# EAGLE design bms_board (EAGLE 6.5.0)
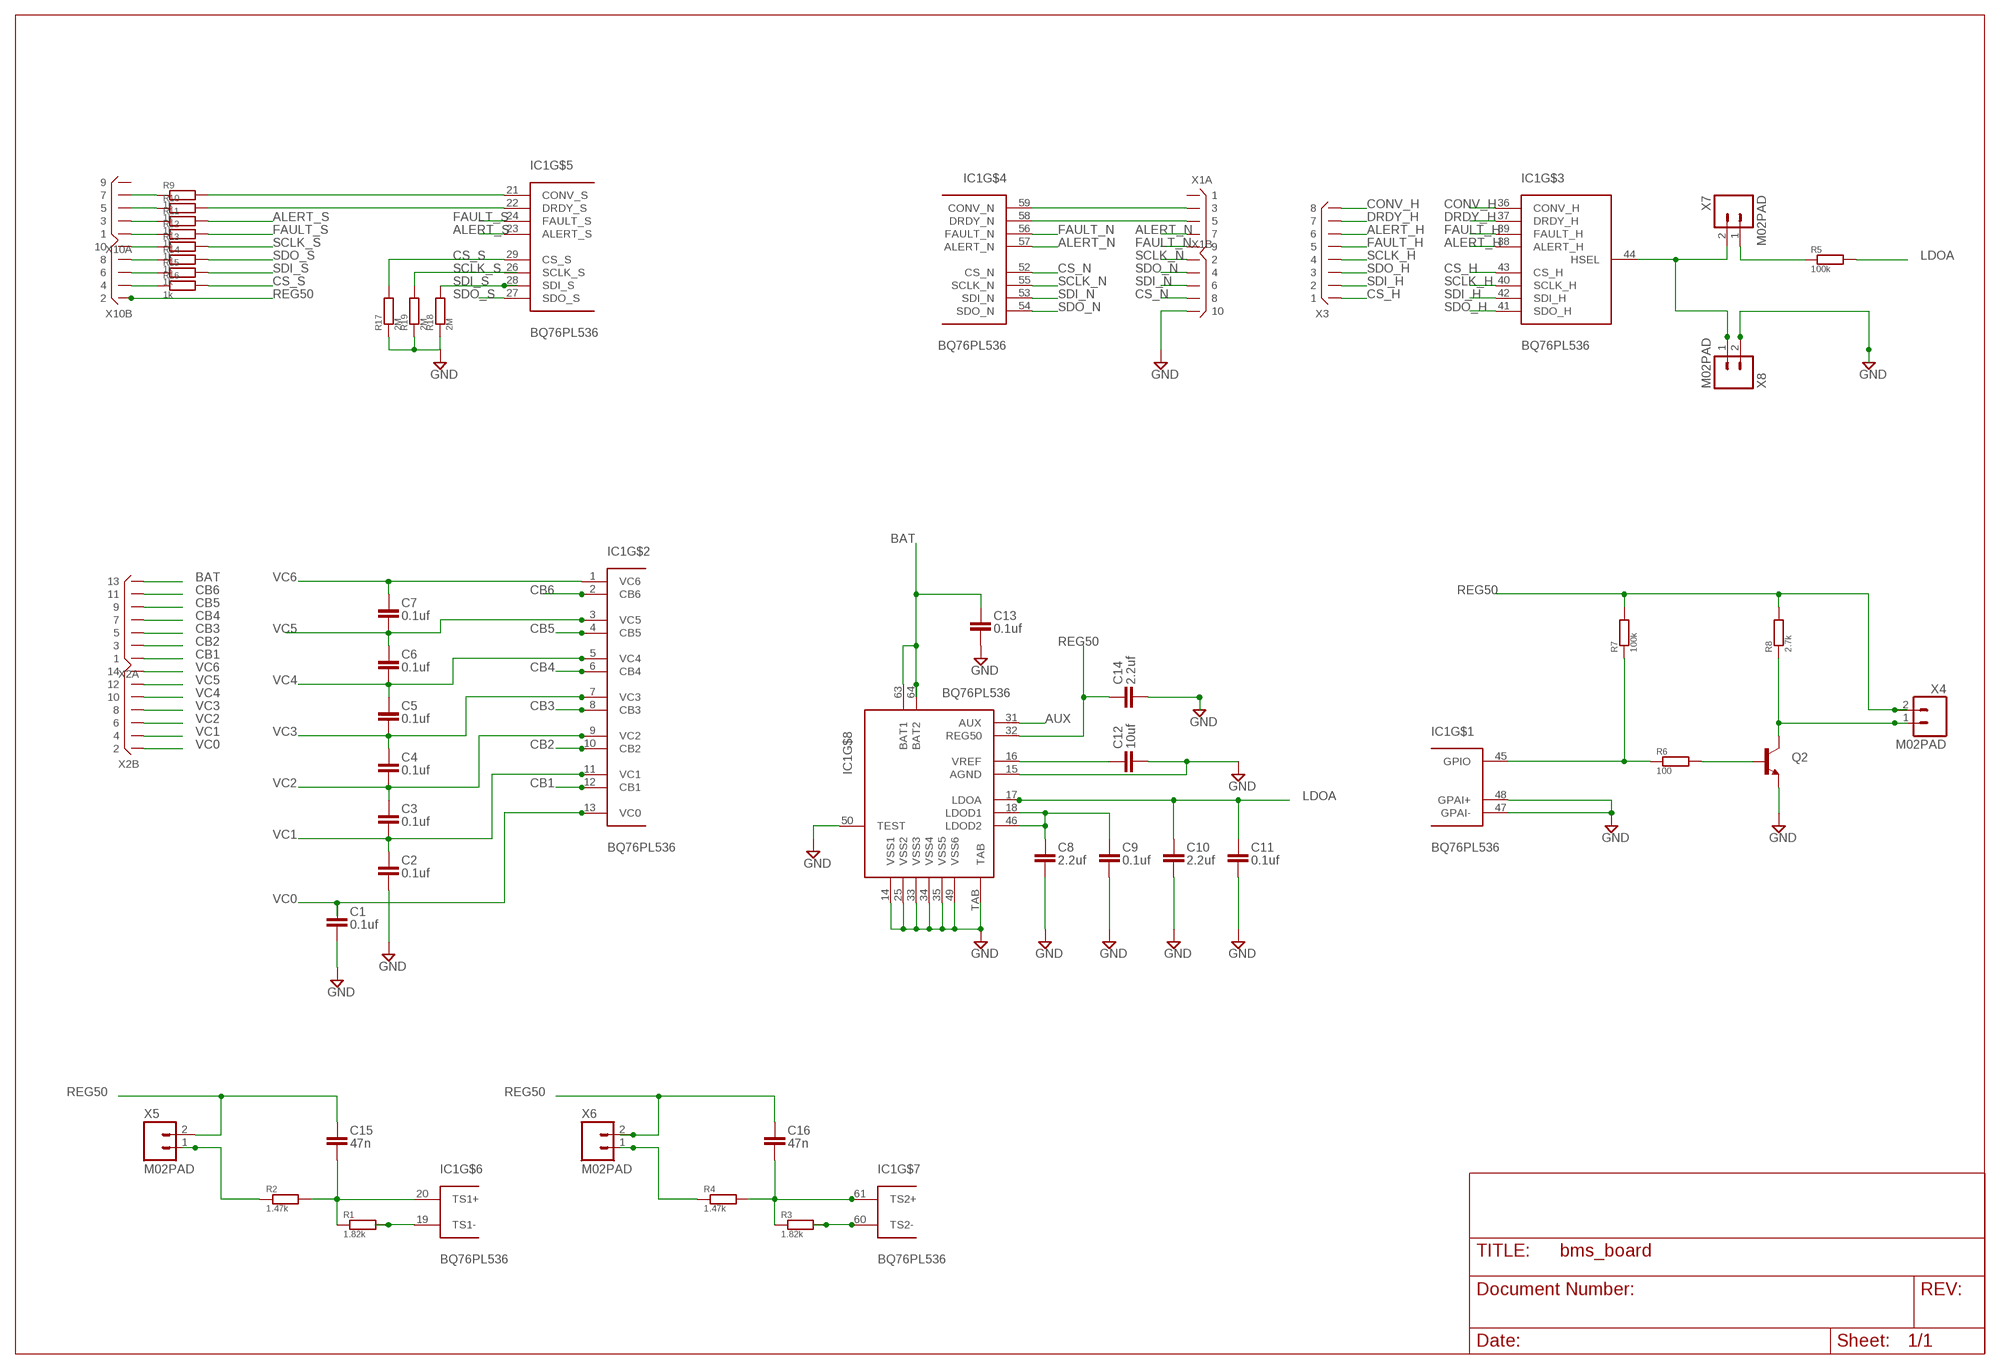
[diagram p0: schematic, sheet 1]

## Parts
C1  0.1uf  CSTD  [C0805]
C2  0.1uf  CSTD  [C0805]
C3  0.1uf  CSTD  [C0805]
C4  0.1uf  CSTD  [C0805]
C5  0.1uf  CSTD  [C0805]
C6  0.1uf  CSTD  [C0805]
C7  0.1uf  CSTD  [C0805]
C8  2.2uf  CSTD  [C0805]
C9  0.1uf  CSTD  [C0805]
C10  2.2uf  CSTD  [C0805]
C11  0.1uf  CSTD  [C0805]
C12  10uf  CSTD  [C0805]
C13  0.1uf  CSTD  [C0805]
C14  2.2uf  CSTD  [C0805]
C15  47n  CSTD  [C0805]
C16  47n  CSTD  [C0805]
IC1  BQ76PL536  [LQFP-64]
Q2  TRANSISTOR_NPNSOT23  [SOT23]
R1  1.82k  R  [R0805]
R2  1.47k  R  [R0805]
R3  1.82k  R  [R0805]
R4  1.47k  R  [R0805]
R5  100k  R  [R0805]
R6  100  R  [R0805]
R7  100k  R  [R0805]
R8  2.7k  R  [R0805]
R9  1k  R  [R0805]
R10  1k  R  [R0805]
R11  1k  R  [R0805]
R12  1k  R  [R0805]
R13  1k  R  [R0805]
R14  1k  R  [R0805]
R15  1k  R  [R0805]
R16  1k  R  [R0805]
R17  2M  R  [R0805]
R18  2M  R  [R0805]
R19  2M  R  [R0805]
X1  X05X2ICR  [X10ICR]
X2  X07X2IR  [X14R-IDC]
X3  X08R  [X08R-SIL]
X4  M02PAD  [1X02]
X5  M02PAD  [1X02]
X6  M02PAD  [1X02]
X7  M02PAD  [1X02]
X8  M02PAD  [1X02]
X10  X05X2ICR  [X10ICR]

## Nets
ALERT_H: IC1.38(ALERT_H) X3.6
ALERT_N: IC1.57(ALERT_N) X1.7
ALERT_S: IC1.23(ALERT_S) R11.2
AUX: IC1.31(AUX)
BAT: C13.2 IC1.63(BAT1) IC1.64(BAT2) X2.13
CB1: IC1.12(CB1) X2.1
CB2: IC1.10(CB2) X2.3
CB3: IC1.8(CB3) X2.5
CB4: IC1.6(CB4) X2.7
CB5: IC1.4(CB5) X2.9
CB6: IC1.2(CB6) X2.11
CONV_H: IC1.36(CONV_H) X3.8
CONV_N: IC1.59(CONV_N) X1.3
CONV_S: IC1.21(CONV_S) R9.2
CS_H: IC1.43(CS_H) X3.1
CS_N: IC1.52(CS_N) X1.8
CS_S: IC1.29(CS_S) R16.2 R17.2
DRDY_H: IC1.37(DRDY_H) X3.7
DRDY_N: IC1.58(DRDY_N) X1.5
DRDY_S: IC1.22(DRDY_S) R10.2
FAULT_H: IC1.39(FAULT_H) X3.5
FAULT_N: IC1.56(FAULT_N) X1.9
FAULT_S: IC1.24(FAULT_S) R12.2
GND: C1.1 C2.1 C8.1 C9.1 C10.1 C11.1 C12.1 C13.1 C14.1 IC1.14(VSS1) IC1.15(AGND) IC1.25(VSS2) IC1.33(VSS3) IC1.34(VSS4) IC1.35(VSS5) IC1.47(GPAI-) IC1.48(GPAI+) IC1.49(VSS6) IC1.50(TEST) IC1.TAB Q2.2(E) R17.1 R18.1 R19.1 X1.10 X8.2
LDOA: C10.2 C11.2 IC1.17(LDOA) R5.2
N$1: IC1.44(HSEL) X7.2 X8.1
N$2: C8.2 C9.2 IC1.18(LDOD1) IC1.46(LDOD2)
N$3: C12.2 IC1.16(VREF)
N$4: IC1.19(TS1-) R1.2
N$5: R2.1 X5.1
N$6: C15.1 IC1.20(TS1+) R1.1 R2.2
N$7: IC1.60(TS2-) R3.2
N$8: C16.1 IC1.61(TS2+) R3.1 R4.2
N$9: R4.1 X6.1
N$10: R5.1 X7.1
N$11: IC1.45(GPIO) R6.1 R7.1
N$12: Q2.1(B) R6.2
N$13: Q2.3(C) R8.1 X4.1
N$23: R16.1 X10.4
N$24: R15.1 X10.6
N$25: R14.1 X10.8
N$26: R13.1 X10.10
N$27: R12.1 X10.1
N$28: R11.1 X10.3
N$29: R10.1 X10.5
N$30: R9.1 X10.7
REG50: C14.2 C15.2 C16.2 IC1.32(REG50) R7.2 R8.2 X4.2 X5.2 X6.2 X10.2
SCLK_H: IC1.40(SCLK_H) X3.4
SCLK_N: IC1.55(SCLK_N) X1.2
SCLK_S: IC1.26(SCLK_S) R13.2 R19.2
SDI_H: IC1.42(SDI_H) X3.2
SDI_N: IC1.53(SDI_N) X1.6
SDI_S: IC1.28(SDI_S) R15.2 R18.2
SDO_H: IC1.41(SDO_H) X3.3
SDO_N: IC1.54(SDO_N) X1.4
SDO_S: IC1.27(SDO_S) R14.2
VC0: C1.2 IC1.13(VC0) X2.2
VC1: C2.2 C3.1 IC1.11(VC1) X2.4
VC2: C3.2 C4.1 IC1.9(VC2) X2.6
VC3: C4.2 C5.1 IC1.7(VC3) X2.8
VC4: C5.2 C6.1 IC1.5(VC4) X2.10
VC5: C6.2 C7.1 IC1.3(VC5) X2.12
VC6: C7.2 IC1.1(VC6) X2.14
Unconnected: X1.1 X10.9

## Library data of the parts
C1-C16 = useful:C
IC1 = ti:BQ76PL536
Q2 = SparkFun:TRANSISTOR_NPN: Transistor NPN BJT configuration in SOT23 package. MMBT2222 is the common NPN we use. Double check BCE configuration again layout.
R1-R19 = useful:R
X1 X10 = connectors:X05X2: Connector 2x5 pins
X2 = connectors:X07X2: Connector 2x7 pins
X3 = connectors:X08: Connector 8 pins
X4-X8 = stiftleisten:M02

## Board
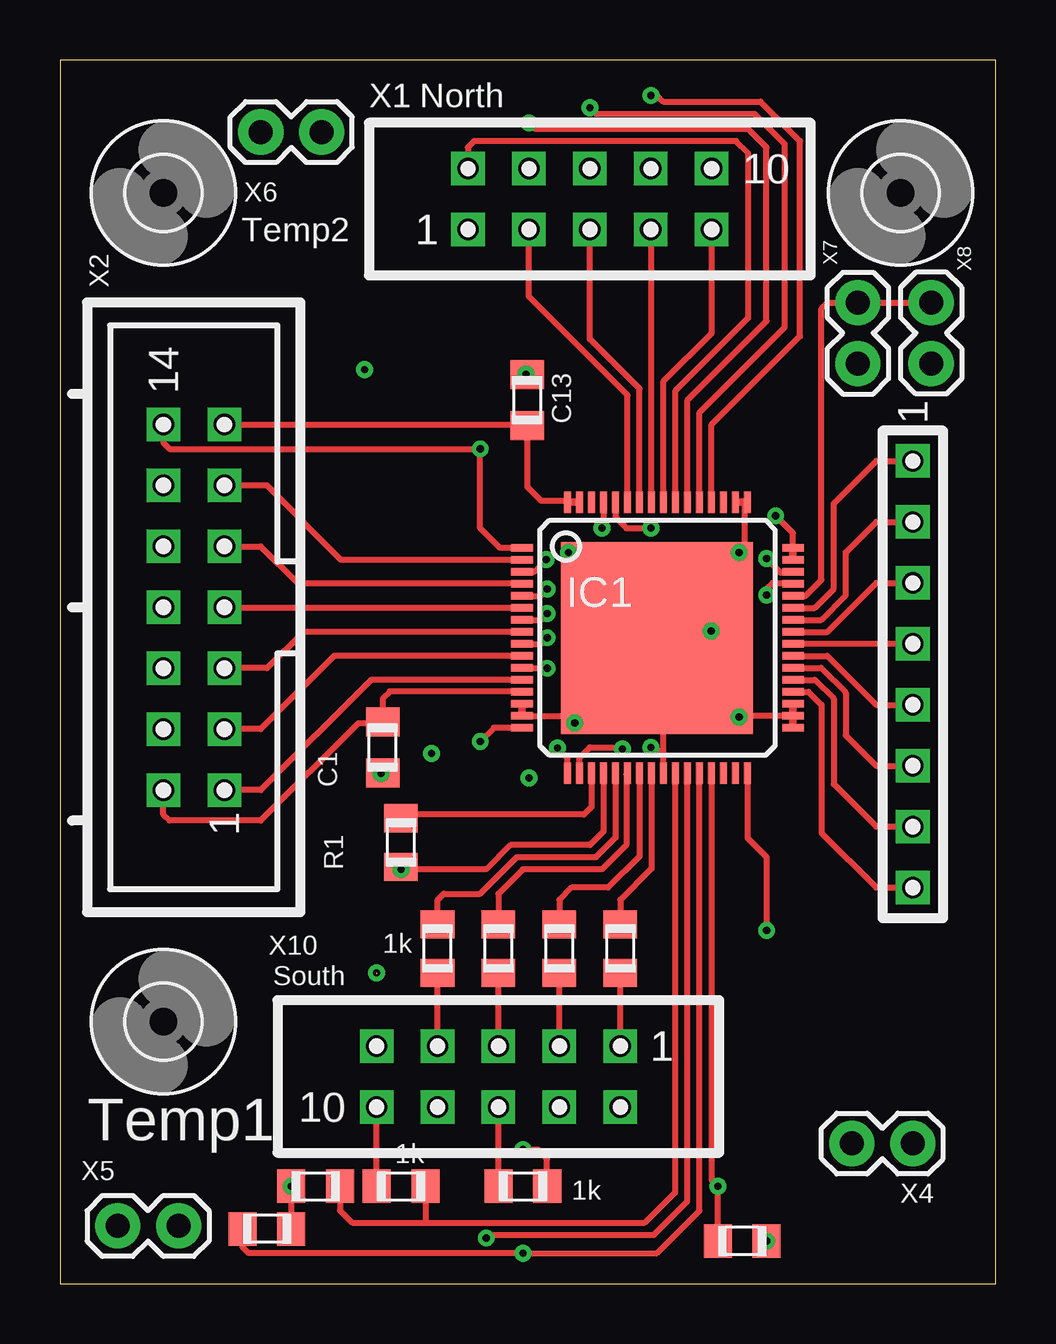
[diagram p1: board, top side]
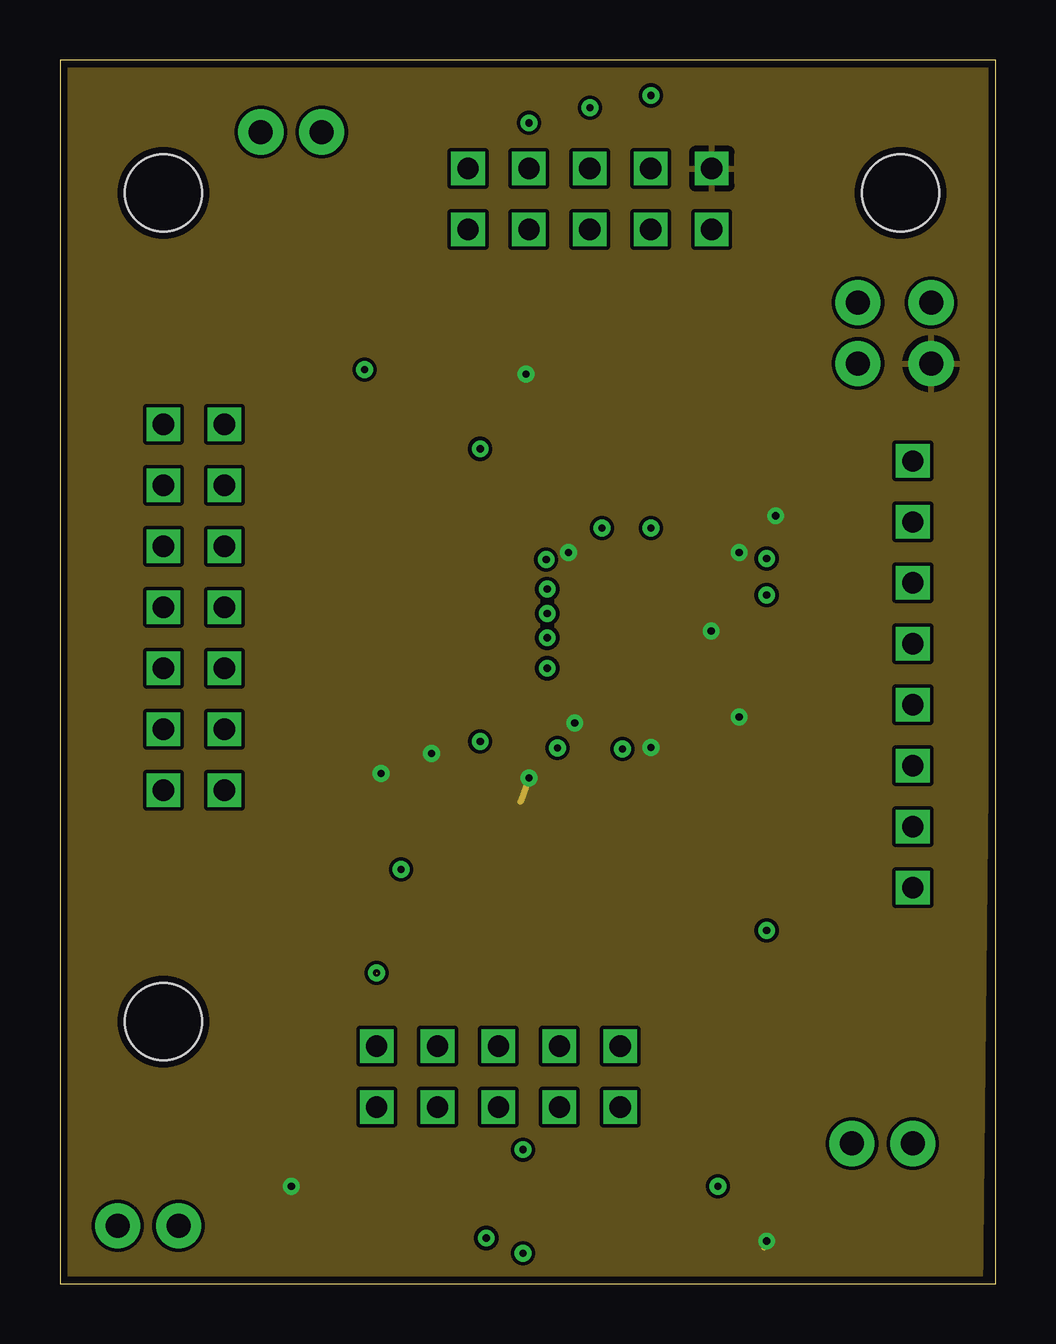
[diagram p2: board, inner layer Route2]
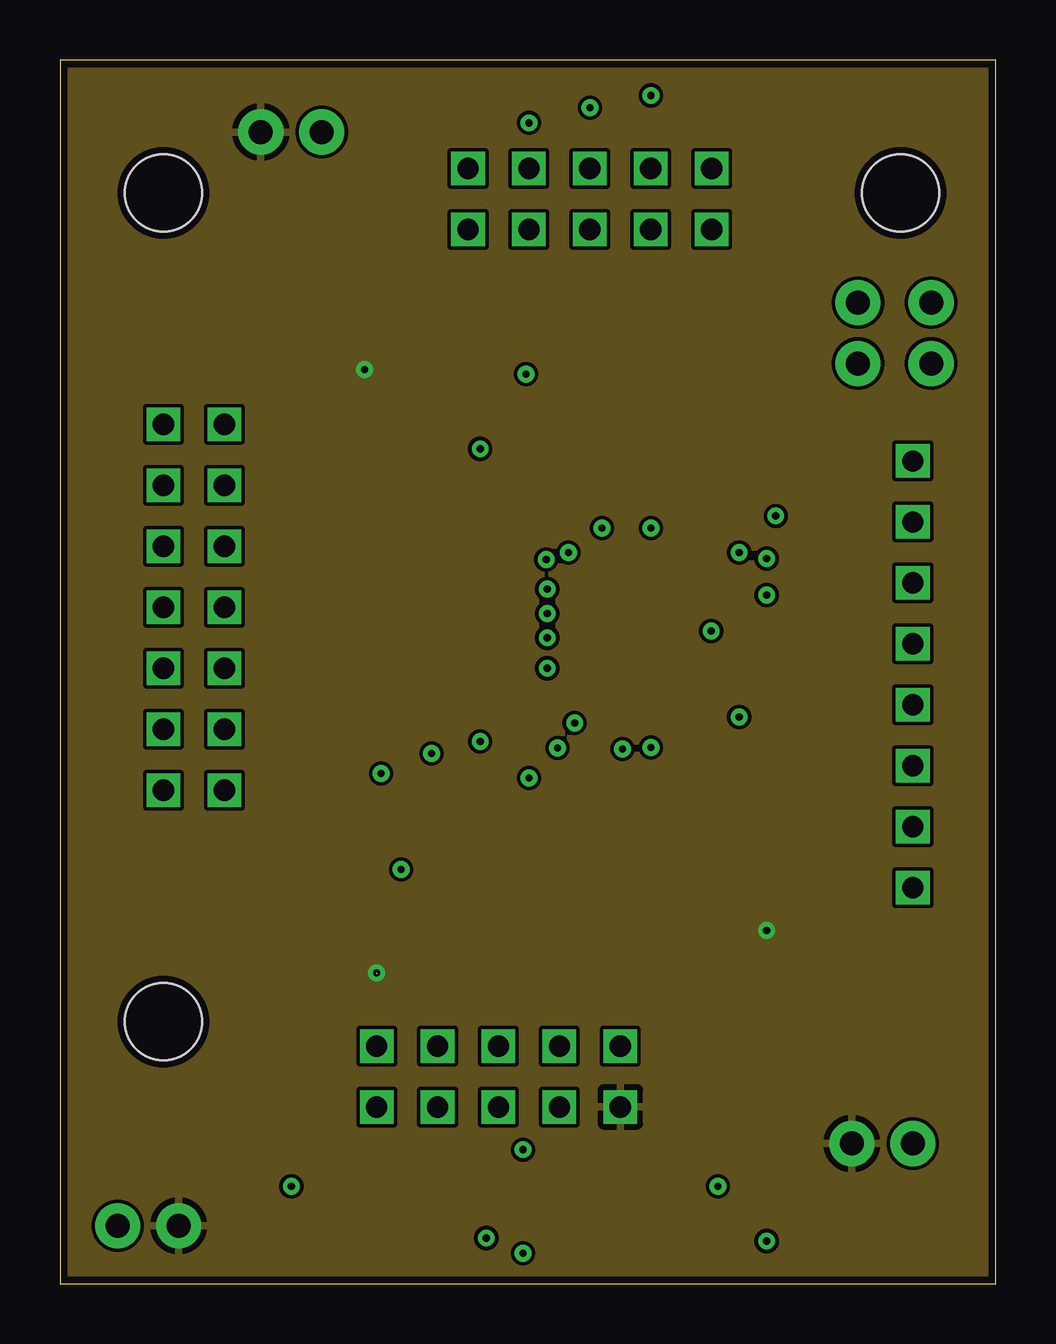
[diagram p3: board, inner layer Route15]
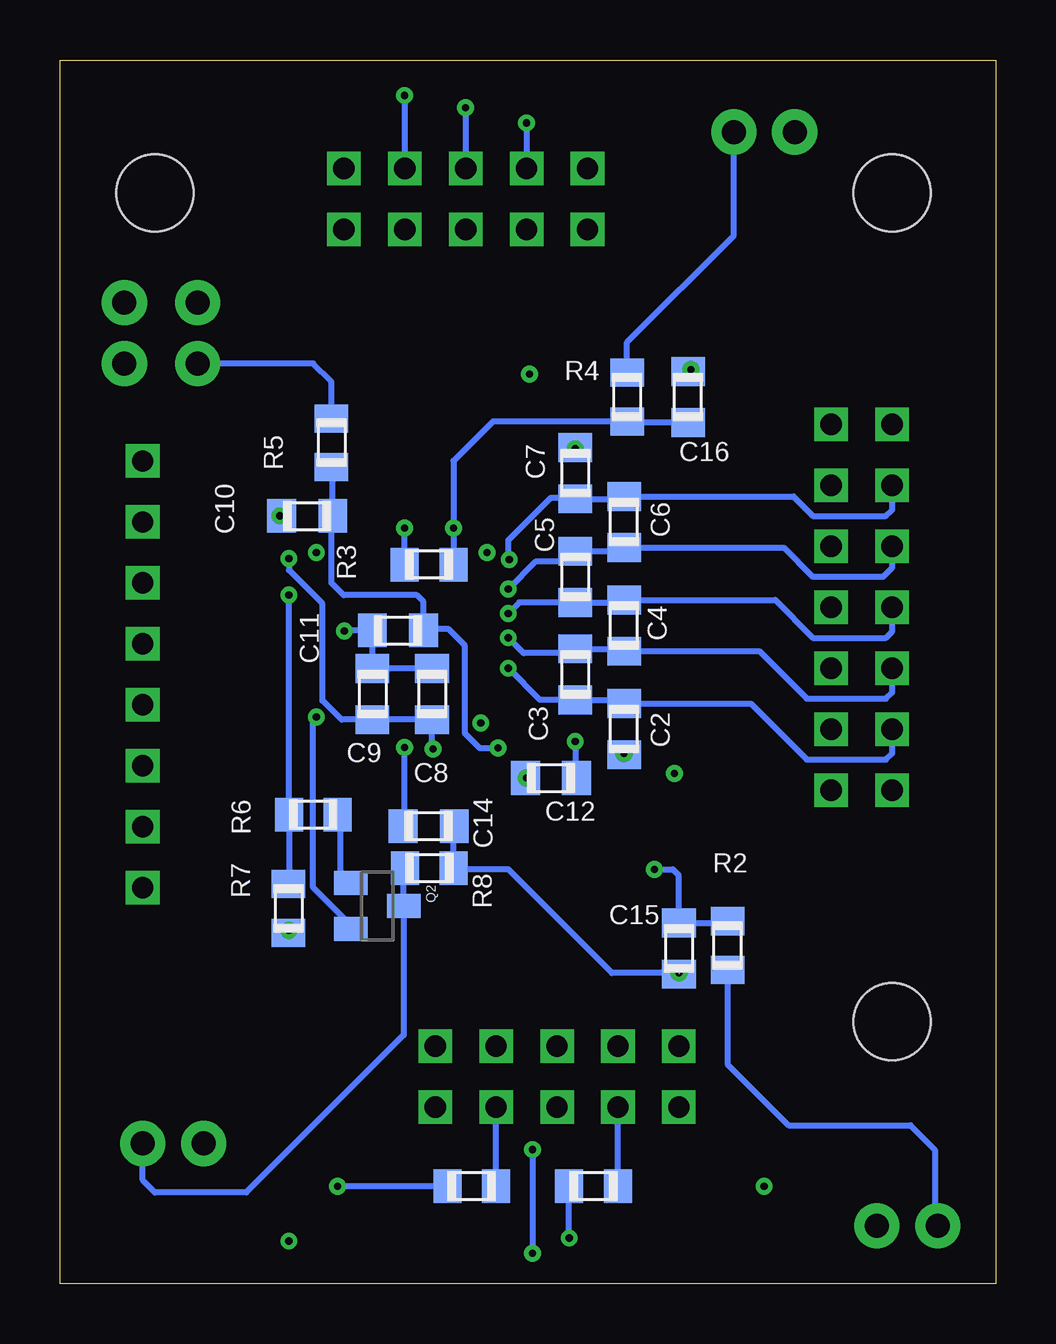
[diagram p4: board, bottom side, seen from below]

Size 39 x 51 mm. Coordinates in mm from the lower left corner, seen from the top.
Outline: 0,0 39,0 39,51 0,51 0,0
Copper layers (1+2*15+16): Top 0.035mm / dielectric 0.2mm / Route2 0.035mm / dielectric 0.5mm / Route15 0.035mm / dielectric 0.2mm / Bottom 0.035mm
Design rules "ats_35u_4layer_2 *": minimum track width 10mil, minimum drill 0.2mm, track to track 6mil, track to pad 6mil, pad to pad 6mil, via to via 6mil, smd to smd 6mil, copper to edge 0.3mm, drill to drill 8mil, minimum pad ring 10mil, minimum via ring 0.2mm, stop-mask expansion 4mil, vias tented up to drill 0mil, thermal gap 10mil

### Footprints (pad centres in the part's own frame; a part is rotated, then mirrored left to right if it is on the bottom)
C0805 = smd 1.2 x 1.4: 1 -1.066,0; 2 1.066,0
LQFP-64 = smd 0.9 x 0.3: 1 -5.625,3.75; 2 -5.625,3.25; 3 -5.625,2.75; 4 -5.625,2.25; 5 -5.625,1.75; 6 -5.625,1.25; 7 -5.625,0.75; 8 -5.625,0.25; 9 -5.625,-0.25; 10 -5.625,-0.75; 11 -5.625,-1.25; 12 -5.625,-1.75; 13 -5.625,-2.25; 14 -5.625,-2.75; 15 -5.625,-3.25; 16 -5.625,-3.75; 33 5.675,-3.75; 34 5.675,-3.25; 35 5.675,-2.75; 36 5.675,-2.25; 37 5.675,-1.75; 38 5.675,-1.25; 39 5.675,-0.75; 40 5.675,-0.25; 41 5.675,0.25; 42 5.675,0.75; 43 5.675,1.25; 44 5.675,1.75; 45 5.675,2.25; 46 5.675,2.75; 47 5.675,3.25; 48 5.675,3.75 | smd 0.3 x 0.9: 17 -3.725,-5.65; 18 -3.225,-5.65; 19 -2.725,-5.65; 20 -2.225,-5.65; 21 -1.725,-5.65; 22 -1.225,-5.65; 23 -0.725,-5.65; 24 -0.225,-5.65; 25 0.275,-5.65; 26 0.775,-5.65; 27 1.275,-5.65; 28 1.775,-5.65; 29 2.275,-5.65; 30 2.775,-5.65; 31 3.275,-5.65; 32 3.775,-5.65; 49 3.775,5.65; 50 3.275,5.65; 51 2.775,5.65; 52 2.275,5.65; 53 1.775,5.65; 54 1.275,5.65; 55 0.775,5.65; 56 0.275,5.65; 57 -0.225,5.65; 58 -0.725,5.65; 59 -1.225,5.65; 60 -1.725,5.65; 61 -2.225,5.65; 62 -2.725,5.65; 63 -3.225,5.65; 64 -3.725,5.65 | smd 8 x 8: TAB 0,0
SOT23 = smd 1 x 1.4: 1 -0.95,-1.1; 2 0.95,-1.1; 3 0,1.1
R0805 = smd 1.168 x 1.397: 1 -1.016,0; 2 1.016,0
3,2 = hole 3.2: 0,0
X10ICR = drill 0.889 pad 1.397 square: 1 -5.08,-1.27; 2 -5.08,1.27; 3 -2.54,-1.27; 4 -2.54,1.27; 5 0,-1.27; 6 0,1.27; 7 2.54,-1.27; 8 2.54,1.27; 9 5.08,-1.27; 10 5.08,1.27
X14R-IDC = drill 0.889 pad 1.397 square: 1 -7.62,-1.27; 2 -7.62,1.27; 3 -5.08,-1.27; 4 -5.08,1.27; 5 -2.54,-1.27; 6 -2.54,1.27; 7 0,-1.27; 8 0,1.27; 9 2.54,-1.27; 10 2.54,1.27; 11 5.08,-1.27; 12 5.08,1.27; 13 7.62,-1.27; 14 7.62,1.27
X08R-SIL = drill 0.889 pad 1.397 square: 1 -8.89,0; 2 -6.35,0; 3 -3.81,0; 4 -1.27,0; 5 1.27,0; 6 3.81,0; 7 6.35,0; 8 8.89,0
1X02 = drill 1 pad 1.88: 1 0,0; 2 2.54,0

### Placement (x,y rotation side)
C1  13.45,22.34 90 top
C2  15.49,23.11 90 bottom
C3  17.52,25.39 90 bottom
C4  15.49,27.42 90 bottom
C5  17.52,29.46 90 bottom
C6  15.49,31.74 90 bottom
C7  17.52,33.77 90 bottom
C8  23.49,24.57 270 bottom
C9  25.98,24.57 270 bottom
C10  28.69,32 0 bottom
C11  24.91,27.22 0 bottom
C12  18.53,21.07 0 bottom
C13  19.47,36.82 270 top
C14  23.63,19.07 0 bottom
C15  13.2,13.96 270 bottom
C16  12.82,36.95 90 bottom
IC1  24.88,26.92 0 top
Q2  25.77,15.74 270 bottom
R1  14.21,18.38 90 top
R2  11.17,14.09 90 bottom
R3  23.61,29.96 180 bottom
R4  15.36,36.95 270 bottom
R5  27.68,35.04 270 bottom
R6  28.44,19.55 0 bottom
R7  29.47,15.63 270 bottom
R8  23.6,17.32 0 bottom
R9  15.74,13.96 90 top
R10  18.28,13.96 90 top
R11  20.82,13.96 90 top
R12  23.36,13.96 90 top
R13  14.22,4.06 0 top
R14  16.76,4.06 180 bottom
R15  19.3,4.06 0 top
R16  21.84,4.06 180 bottom
R17  28.44,1.77 180 top
R18  8.63,2.28 180 top
R19  10.66,4.06 0 top
U$3  [3,2]  4.31,45.46 0 top
U$4  [3,2]  4.31,10.91 0 top
U$6  [3,2]  35.04,45.46 0 top
X1  22.09,45.2 0 top
X2  5.58,28.19 90 top
X3  35.55,25.39 270 top
X4  35.55,5.83 180 top
X5  2.4,2.4 0 top
X6  10.91,48 180 top
X7  33.27,38.35 90 top
X8  36.31,40.89 270 top
X10  18.28,8.63 180 top

### Tracks (layer width: path | path; a pad name or v marks a point on that pad's centre or on a via)
ALERT_H
  Top 0.254: IC1.38 31.72,25.67 32.76,24.63 32.76,22.85 34.03,21.58 X3.6
ALERT_N
  Top 0.254: IC1.57 24.66,43.91 X1.7
ALERT_S
  Top 0.254: IC1.23 24.16,17.81 22.85,16.5 21.33,16.5 20.82,15.99 R11.2
BAT
  Top 0.254: X2.13 19.42,35.81 C13.2 19.47,33.22 20.06,32.63 21.09,32.63 IC1.64
  Top 0.305: IC1.63 IC1.64
CB1
  Top 0.254: IC1.12 12.97,25.17 8.37,20.57 X2.1
CB2
  Top 0.254: IC1.10 11.43,26.17 8.37,23.11 X2.3
CB3
  Top 0.254: IC1.8 10.15,27.17 8.63,25.65 X2.5
CB4
  Top 0.254: IC1.6 6.87,28.17 X2.7
CB5
  Top 0.254: X2.9 8.37,30.73 9.9,29.2 19.22,29.2 IC1.4
CB6
  Top 0.254: IC1.2 11.73,30.17 8.63,33.27 X2.11
CONV_H
  Top 0.254: IC1.36 31.2,24.67 31.74,24.12 31.74,18.79 34.03,16.5 X3.8
CONV_N
  Top 0.254: IC1.59 23.66,37.03 19.55,41.14 X1.3
CONV_S
  Top 0.254: R9.2 15.74,15.99 15.99,16.25 17.52,16.25 19.04,17.77 22.34,17.77 23.16,18.59 IC1.21
CS_H
  Top 0.254: IC1.43 31.47,28.17 32.25,28.95 32.25,32.5 34.03,34.28 X3.1
CS_N  (via drill 0.3)
  Top 0.254: IC1.52 27.16,35.8 30.85,39.49 30.85,47.62 29.2,49.27 25.14,49.27 24.88,49.52 v24.63,49.52
  Bottom 0.254: v24.63,49.52 X1.8
CS_S  (via drill 0.3)
  Top 0.254: IC1.29 27.17,21.25 27.17,4.31 v27.42,4.06 R17.2
  Bottom 0.254: R16.2 v27.42,4.06
DRDY_H
  Top 0.254: IC1.37 31.46,25.17 32.25,24.38 32.25,20.82 34.03,19.04 X3.7
DRDY_N
  Top 0.254: IC1.58 24.16,37.29 22.09,39.36 X1.5
DRDY_S
  Top 0.254: IC1.22 23.61,21.22 23.61,18.28 22.6,17.26 19.3,17.26 18.28,16.25 R10.2
FAULT_H
  Top 0.254: IC1.39 31.98,26.17 34.03,24.12 X3.5
FAULT_N
  Top 0.254: IC1.56 25.16,37.6 27.17,39.62 X1.9
FAULT_S
  Top 0.254: IC1.24 24.66,17.29 23.36,15.99 R12.2
GND  (via drill 0.3)
  Top 0.254: C1.1 13.38,21.25 v13.39,21.27 | C13.1 v19.42,37.9 | 21.53,23.61 21.71,23.61 arc-127 v21.45,23.36 | v21.45,23.36 21.33,23.36 | IC1.15 21.15,23.67 v21.45,23.36 | 28.55,30.71 28.55,32.46 IC1.49 | 25.16,22.11 25.16,24.16 25.01,24.31 27.36,24.31 v28.31,23.61 28.36,23.67 IC1.34 | IC1.25 25.16,22.11 | 25.16,22.11 v24.63,22.34 | IC1.48 30.56,31.27 v29.84,32 | R19.1 R18.1
  Top 0.305: IC1.15 IC1.14 | IC1.48 IC1.47 | 28.45,30.61 v28.31,30.47 28.55,30.71 | IC1.50 IC1.49 | 28.57,23.61 v28.31,23.61 | IC1.35 IC1.34 IC1.33
  Top 0.406: IC1.TAB 21.53,23.61
  Route2 0.254: v19.55,21.07 19.2,20.08 | R17.1 29.36,1.5
  Bottom 0.254: 15.61,22.09 C2.1 v15.49,22.09 | C8.1 C9.1 C11.1 27.12,27.22 v27.14,27.2 | C12.1 19.6,21.28 v19.55,21.07 | 24.72,19.04 C14.1 24.63,19.13 v24.63,22.34 24.38,22.34 | v29.84,32 C10.1 | Q2.2 26.87,14.94 28.44,16.5 28.44,23.49 v28.31,23.61
  other vias: 21.2,30.47 29.46,1.77 9.64,4.06
  pour Route2: -0.42,-0.27 38.37,-0.4 38.94,50.96 0.15,51.06
LDOA  (via drill 0.3)
  Top 0.254: IC1.17 21.16,21.9 v20.74,22.32
  Bottom 0.254: v20.74,22.32 21.51,22.32 22.11,22.93 22.11,26.59 22.8,27.27 23.8,27.27 C11.2 23.85,28.42 24.12,28.69 27.17,28.69 27.68,29.2 27.68,31.95 C10.2 27.63,33.98 R5.2
N$1
  Top 0.254: IC1.44 31.08,28.67 31.74,29.33 31.74,40.63 32,40.89 X7.2 X8.1
N$2  (via drill 0.3)
  Top 0.254: 23.41,22.24 v23.45,22.28 23.39,22.34 22.09,22.34 21.66,21.91 IC1.18 | IC1.46 30.44,29.63 30.04,29.63 v29.46,30.22
  Bottom 0.254: v23.45,22.28 23.49,22.32 C8.2 C9.2 27.26,23.5 28.06,24.3 28.06,28.34 29.46,29.73 v29.46,30.22
N$3  (via drill 0.3)
  Top 0.254: IC1.16 18.09,23.17 v17.52,22.6
  Bottom 0.254: v17.52,22.6 17.52,21.12 C12.2
N$4
  Top 0.254: IC1.19 22.16,19.87 21.84,19.55 14.37,19.55 R1.2
N$5
  Bottom 0.254: R2.1 11.17,9.14 8.63,6.6 3.55,6.6 2.53,5.58 2.53,2.53 X5.1
N$6  (via drill 0.3)
  Top 0.254: IC1.20 22.66,18.85 22.09,18.28 18.79,18.28 17.77,17.26 14.31,17.26 R1.1 14.06,17.36 v14.22,17.26
  Bottom 0.254: v14.22,17.26 13.45,17.26 13.2,17.01 C15.1 11.24,15.03 R2.2
N$7  (via drill 0.3)
  Top 0.254: IC1.60 23.16,31.94 23.61,31.49 v24.63,31.49
  Bottom 0.254: R3.2 v24.63,31.49
N$8  (via drill 0.3)
  Top 0.254: IC1.61 22.66,31.55 v22.6,31.49
  Bottom 0.254: R3.1 v22.6,31.49 22.6,34.28 20.95,35.93 R4.2 | 15.31,35.88 R4.2 | C16.1 15.36,35.88 R4.2
N$9
  Bottom 0.254: R4.1 15.36,39.23 10.91,43.68 X6.1
N$10
  Bottom 0.254: R5.1 27.68,37.58 28.44,38.35 X7.1
N$11  (via drill 0.3)
  Top 0.254: v29.46,28.69 29.46,28.95 29.71,29.2 30.52,29.2 IC1.45
  Bottom 0.254: v29.46,28.69 R6.1 29.46,16.67 R7.1
N$12
  Bottom 0.254: Q2.1 26.87,16.76 27.3,16.76 27.3,19.55 R6.2
N$13
  Bottom 0.254: R8.1 24.67,17.32 Q2.3 24.67,10.36 31.23,3.8 35.04,3.8 35.55,4.31 X4.1
N$23
  Bottom 0.254: R16.1 X10.4
N$24
  Top 0.254: R15.1 X10.6
N$25
  Bottom 0.254: R14.1 X10.8
N$26
  Top 0.254: R13.1 X10.10
N$27
  Top 0.254: X10.1 R12.1
N$28
  Top 0.254: X10.3 R11.1
N$29
  Top 0.254: X10.5 R10.1
N$30
  Top 0.254: X10.7 R9.1
REG50  (via drill 0.3)  (1 unrouted)
  Top 0.254: IC1.32 28.66,18.57 29.46,17.77 v29.46,14.72
  Bottom 0.254: R8.2 22.59,19.04 C14.2 | 29.58,14.72 R7.2 29.46,14.63 v29.46,14.72 | C16.2 12.82,37.97 v12.69,38.09 | R8.2 22.4,17.32 | v13.2,12.95 15.99,12.95 20.31,17.26 22.53,17.26 R8.2
  pour Route15: 0.11,51.01 39.11,50.97 39.11,-0.14 -0.02,0.3
SCLK_H
  Top 0.254: X3.4 IC1.40
SCLK_N
  Top 0.254: IC1.55 25.66,37.22 28.69,40.25 28.69,47.11 28.19,47.62 17.26,47.62 17.01,47.36 X1.2
SCLK_S
  Top 0.254: 15.23,2.53 12.18,2.53 11.68,3.04 R19.2 | 15.23,2.53 24.38,2.53 25.65,3.8 25.65,21.25 IC1.26 | R13.2 15.23,2.53
SDI_H
  Top 0.254: IC1.42 31.73,27.67 32.76,28.69 32.76,30.47 34.03,31.74 X3.2
SDI_N  (via drill 0.3)
  Top 0.254: IC1.53 26.66,36.31 30.22,39.87 30.22,47.49 28.95,48.76 22.34,48.76 v22.09,49.01
  Bottom 0.254: v22.09,49.01 X1.6
SDI_S  (via drill 0.3)
  Top 0.254: IC1.28 26.66,3.04 24.88,1.26 v19.3,1.26 7.87,1.26 7.61,1.52 R18.2 | R15.2 20.31,5.2 19.93,5.58 v19.3,5.58
  Bottom 0.254: v19.3,5.58 v19.3,1.26
SDO_H
  Top 0.254: IC1.41 31.99,27.17 34.03,29.2 X3.3
SDO_N  (via drill 0.3)
  Top 0.254: IC1.54 26.16,36.83 29.46,40.12 29.46,47.36 28.69,48.12 19.8,48.12 v19.55,48.38
  Bottom 0.254: v19.55,48.38 X1.4
SDO_S  (via drill 0.3)
  Top 0.254: v17.77,1.9 17.9,1.9 18.03,2.02 24.76,2.02 26.15,3.42 IC1.27
  Bottom 0.254: v17.77,1.9 R14.2
VC0
  Top 0.254: IC1.13 19.25,24.68 13.76,24.68 13.45,24.38 C1.2 13.4,23.36 12.44,23.36 8.37,19.3 4.56,19.3 4.31,19.55 X2.2
VC1  (via drill 0.3)
  Top 0.254: IC1.11 20.29,25.67 v20.31,25.65
  Bottom 0.254: v20.31,25.65 18.99,24.33 C3.1 15.64,24.33 C2.2 10.2,24.17 7.87,21.84 4.56,21.84 4.31,22.09 X2.4
VC2  (via drill 0.3)
  Top 0.254: IC1.9 20.06,26.67 v20.31,26.92
  Bottom 0.254: 17.64,26.28 19.68,26.28 v20.31,26.92 | C3.2 15.59,26.46 C4.1 9.85,26.36 7.87,24.38 4.56,24.38 4.31,24.63 X2.6
  Bottom 0.305: C3.2 17.64,26.28
VC3  (via drill 0.3)
  Top 0.254: IC1.7 20.05,27.67 v20.31,27.93
  Bottom 0.254: v20.31,27.93 19.85,28.39 C5.1 15.59,28.39 C4.2 9.19,28.49 7.61,26.92 4.56,26.92 4.31,27.17 X2.8
VC4  (via drill 0.3)
  Top 0.254: IC1.5 20.03,28.67 v20.31,28.95
  Bottom 0.254: C5.2 15.64,30.52 C6.1 8.83,30.68 7.61,29.46 4.69,29.46 4.31,29.84 X2.10 | 17.64,30.09 19.17,30.09 v20.31,28.95
  Bottom 0.305: C5.2 17.64,30.09 17.64,30.17
VC5  (via drill 0.3)
  Top 0.254: IC1.3 19.76,29.67 v20.27,30.17
  Bottom 0.254: v20.27,30.17 20.31,30.22 20.31,30.98 18.53,32.76 17.57,32.76 C7.1 15.59,32.71 C6.2 8.42,32.81 7.61,32 4.56,32 4.31,32.25 X2.12
VC6  (via drill 0.3)
  Top 0.254: X2.14 4.31,35.04 4.56,34.79 v17.52,34.79 17.52,31.49 18.34,30.67 IC1.1
  Bottom 0.254: v17.52,34.79 17.47,34.79 C7.2

### Text on the board
tPlace: North | South
tNames: Temp2 | 1k | Temp1 | 1k | 1k
tValues: 2M | 2M | 2M
tTest: SLAVE | BMS V1 / Moni